# Altium schematic sheet uController.SchDoc
size A3; SheetNumber: 1; SheetTotal: 5
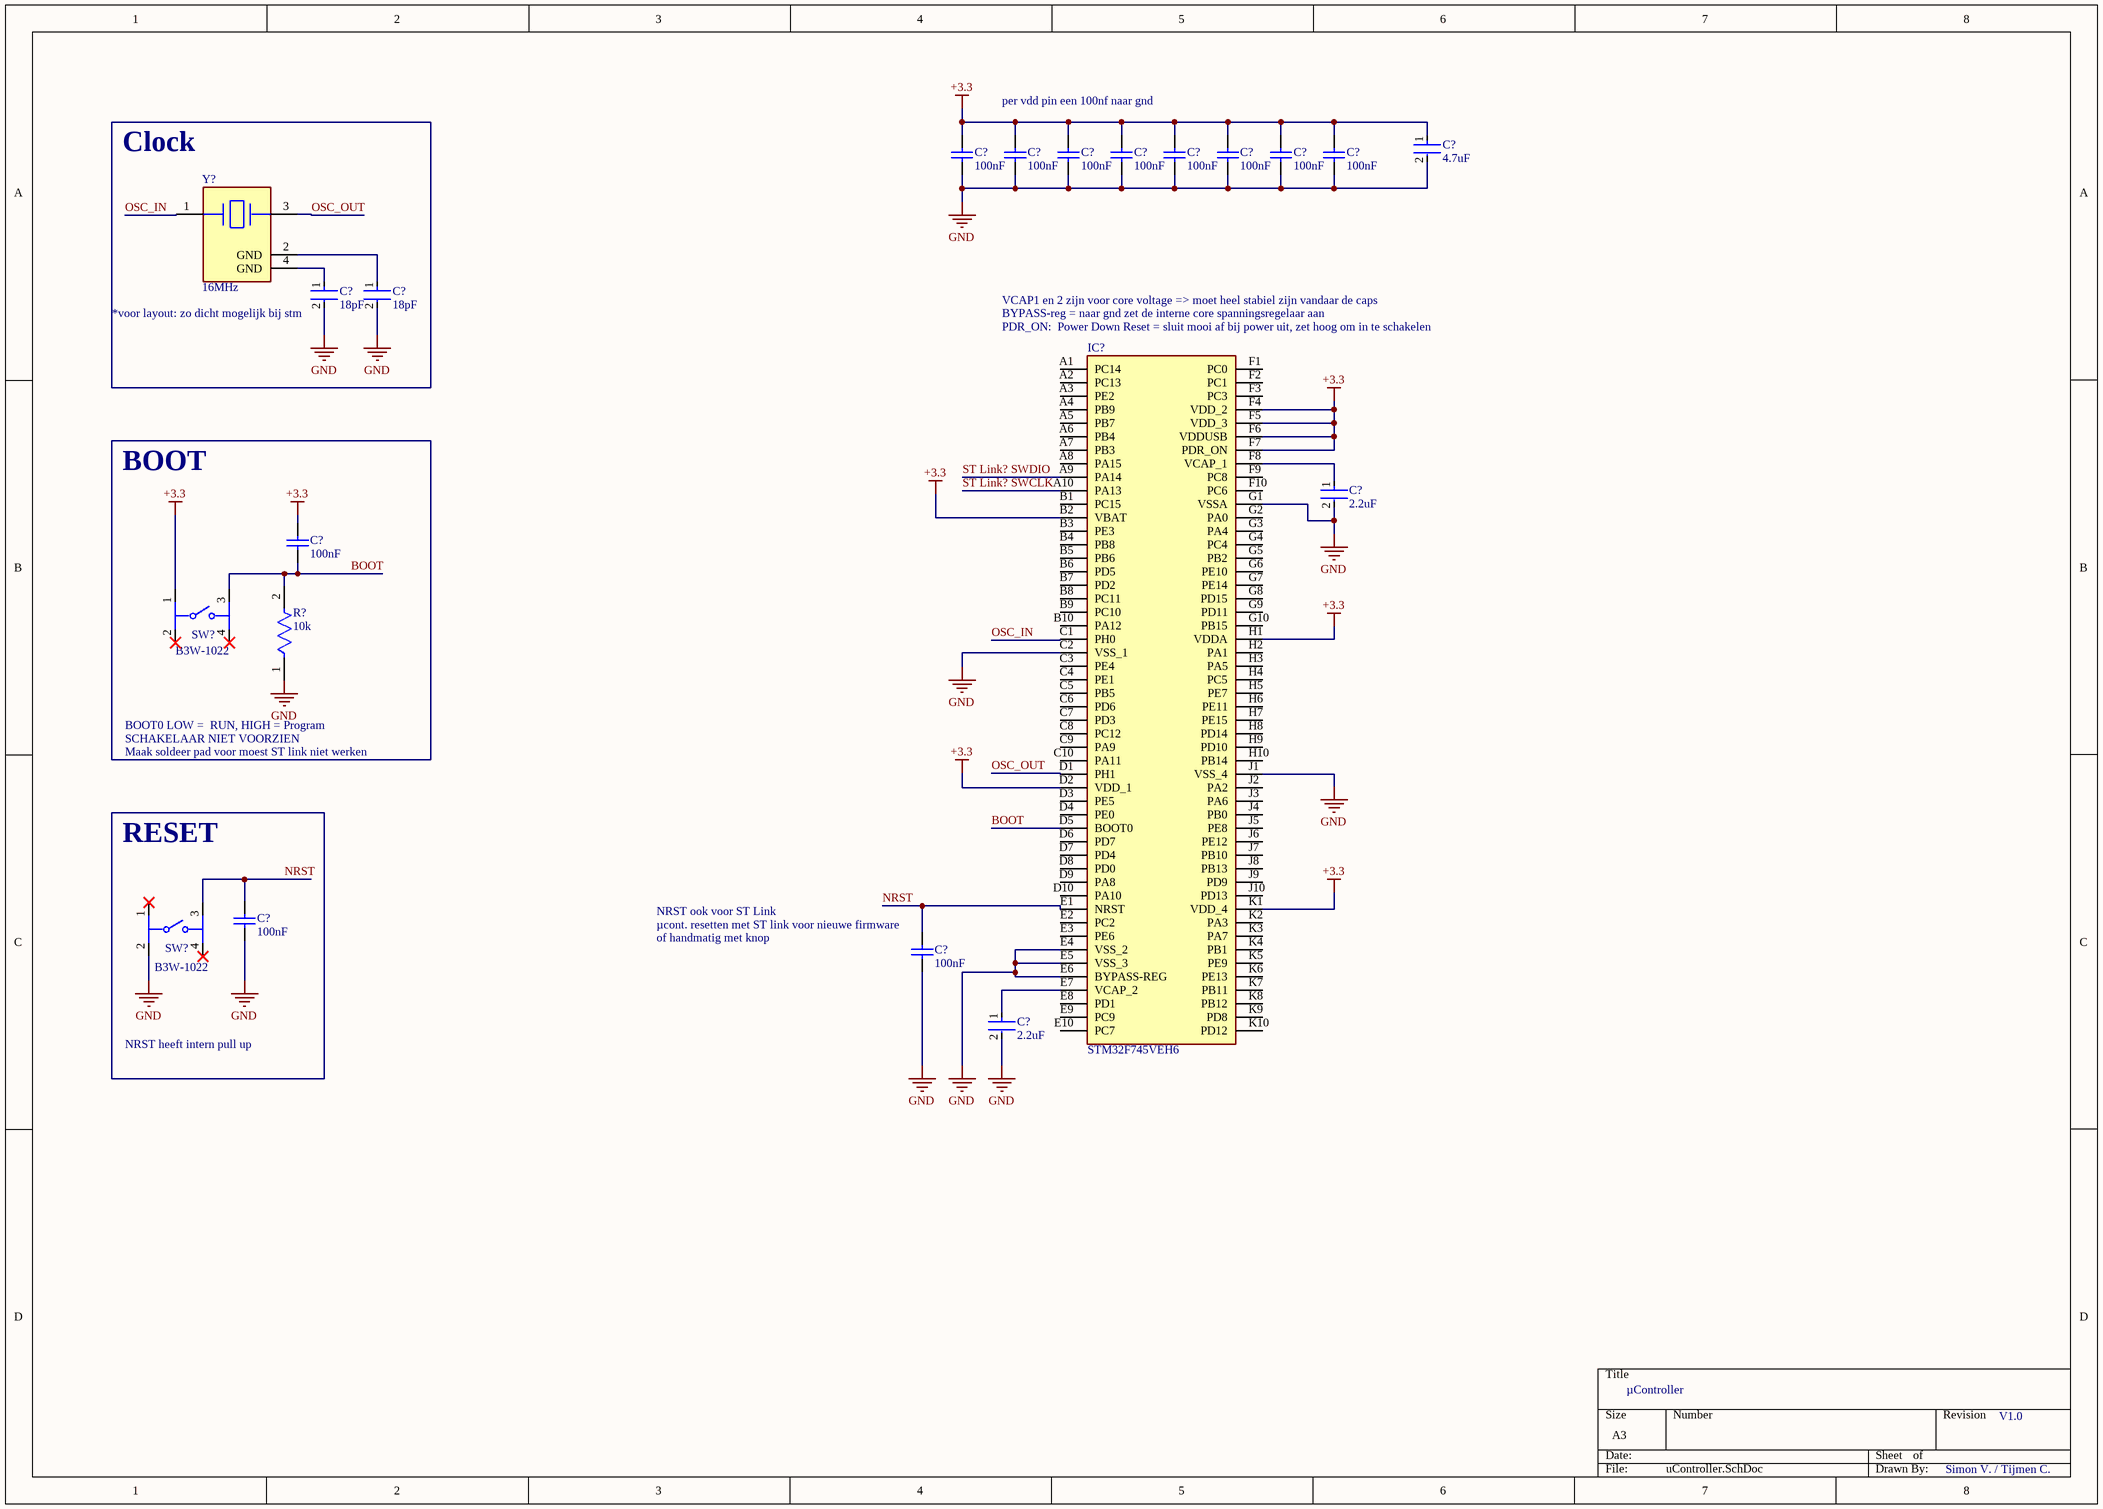
[diagram p0: uController.SchDoc]

## Parts
(Parts that share a designator on the sheet are numbered #1, #2 ... from top to bottom, then left to right.)
C?#1  4.7uF  [FP-CC0603-DC-MFG]
C?#2  100nF  [CAPC1608X92X38ML15T08]
C?#3  100nF  [CAPC1608X92X38ML15T08]
C?#4  100nF  [CAPC1608X92X38ML15T08]
C?#5  100nF  [CAPC1608X92X38ML15T08]
C?#6  100nF  [CAPC1608X92X38ML15T08]
C?#7  100nF  [CAPC1608X92X38ML15T08]
C?#8  100nF  [CAPC1608X92X38ML15T08]
C?#9  100nF  [CAPC1608X92X38ML15T08]
C?#10  18pF  [FP-C0603C-CF-MFG]
C?#11  18pF  [FP-C0603C-CF-MFG]
C?#12  2.2uF  [FP-CC0603-DA-MFG]
C?#13  100nF  [CAPC1608X92X38ML15T08]
C?#14  100nF  [CAPC1608X92X38ML15T08]
C?#15  100nF  [CAPC1608X92X38ML15T08]
C?#16  2.2uF  [FP-CC0603-DA-MFG]
IC?  STM32F745VEH6  [BGA100C80P10X10_800X800X110]
R?  10k  [FP-MCT0603-MFG]
SW?#1  B3W-1022  [FP-B3W-1022-MFG]
SW?#2  B3W-1022  [FP-B3W-1022-MFG]
Y?  16MHz  [FP-ABM8-MFG]

## Nets
+3.3: C?#1.1 C?#2.2 C?#3.2 C?#4.2 C?#5.2 C?#6.2 C?#7.2 C?#8.2 C?#9.2 C?#13.2 IC?.B2(VBAT) IC?.D2(VDD_1) IC?.F4(VDD_2) IC?.F5(VDD_3) IC?.F6(VDDUSB) IC?.F7(PDR_ON) IC?.H1(VDDA) IC?.K1(VDD_4) SW?#1.1
GND: C?#1.2 C?#2.1 C?#3.1 C?#4.1 C?#5.1 C?#6.1 C?#7.1 C?#8.1 C?#9.1 C?#10.2 C?#11.2 C?#12.2 C?#14.1 C?#15.1 C?#16.2 IC?.C2(VSS_1) IC?.E4(VSS_2) IC?.E5(VSS_3) IC?.E6(BYPASS-REG) IC?.G1(VSSA) IC?.J1(VSS_4) R?.1 SW?#2.2
BOOT: C?#13.1 IC?.D5(BOOT0) R?.2 SW?#1.3
NRST: C?#14.2 C?#15.2 IC?.E1(NRST) SW?#2.3
OSC_IN: IC?.C1(PH0) Y?.1
OSC_OUT: IC?.D1(PH1) Y?.3
ST Link? SWCLK: IC?.A10(PA13)
ST Link? SWDIO: IC?.A9(PA14)
NetC?#10_1: C?#10.1 Y?.4(GND)
NetC?#11_1: C?#11.1 Y?.2(GND)
NetC?#12_1: C?#12.1 IC?.F8(VCAP_1)
NetC?#16_1: C?#16.1 IC?.E7(VCAP_2)

Not connected (* = marked no-connect by the designer): IC? A1(PC14) A2(PC13) A3(PE2) A4(PB9) A5(PB7) A6(PB4) A7(PB3) A8(PA15) B1(PC15) B3(PE3) B4(PB8) B5(PB6) B6(PD5) B7(PD2) B8(PC11) B9(PC10) B10(PA12) C3(PE4) C4(PE1) C5(PB5) C6(PD6) C7(PD3) C8(PC12) C9(PA9) C10(PA11) D3(PE5) D4(PE0) D6(PD7) D7(PD4) D8(PD0) D9(PA8) D10(PA10) E2(PC2) E3(PE6) E8(PD1) E9(PC9) E10(PC7) F1(PC0) F2(PC1) F3(PC3) F9(PC8) F10(PC6) G2(PA0) G3(PA4) G4(PC4) G5(PB2) G6(PE10) G7(PE14) G8(PD15) G9(PD11) G10(PB15) H2(PA1) H3(PA5) H4(PC5) H5(PE7) H6(PE11) H7(PE15) H8(PD14) H9(PD10) H10(PB14) J2(PA2) J3(PA6) J4(PB0) J5(PE8) J6(PE12) J7(PB10) J8(PB13) J9(PD9) J10(PD13) K2(PA3) K3(PA7) K4(PB1) K5(PE9) K6(PE13) K7(PB11) K8(PB12) K9(PD8) K10(PD12); SW?#1 2* 4*; SW?#2 1* 4*

## Notes on the sheet
- (near C?#3) per vdd pin een 100nf naar gnd
- Clock
- (near C?#10) *voor layout: zo dicht mogelijk bij stm
- VCAP1 en 2 zijn voor core voltage => moet heel stabiel zijn vandaar de caps
- (near IC?) BYPASS-reg = naar gnd zet de interne core spanningsregelaar aan
- (near IC?) PDR_ON:  Power Down Reset = sluit mooi af bij power uit, zet hoog om in te schakelen
- BOOT
- BOOT0 LOW =  RUN, HIGH = Program
- SCHAKELAAR NIET VOORZIEN
- Maak soldeer pad voor moest ST link niet werken
- RESET
- NRST ook voor ST Link
- (near C?#15) µcont. resetten met ST link voor nieuwe firmware
- of handmatig met knop
- NRST heeft intern pull up
- µController
- V1.0
- Simon V. / Tijmen C.

## Library data of the parts
C?#1 = CMP-03422-001038-2: CAP CER 4.7UF 6.3V X7R 0603; Tolerance: 20%; RoHS Compliant: Yes; Packaging: Cut Tape; Mount: Surface Mount; Case Code (Imperial): 0603; Voltage Rating: 6.3V; Min Operating Temperature: -55°C; Case/Package: 0603; Case Code (Metric): 1608; Max Operating Temperature: 125°C; Capacitance: 4.7uF
C?#2-C?#9 C?#13-C?#15 = CMP-2006-01140-1: Part Number: VJ0603Y104MXXAC; Manufacturer: Vitramon
C?#10 C?#11 = CMP-03020-018448-1: C0603 18 pF C0G 30ppm/°C 1.00% 50 V; Manufacturer: KEMET; Manufacturer Part Number: C0603C180F5GACAUTO; Voltage Rating: 50 V; Automotive Grade: Grade 1; Tolerance: 0.01; Material: Ceramic; Height: 0.87mm; Lead Free: Yes; Category: Cap; Capacitance: 18 pF; Temperature Characteristic: C0G; Device Class L3: Ceramic Capacitors; Package: C0603C-CF; ComponentLink2Description: Datasheet; Automotive: Yes; Temperature Range Low: -55°C; Device Class L1: Passive Components; ComponentLink2URL: https://api.kemet.com/component-edge/download/datasheet/C0603C100J5GACAUTO.pdf; Octopart: https://octopart.com/c0603c180f5gacauto-kemet-91893831; Value: 18 pF; Temperature: -55°C to +125°C; Temperature Range High: +125°C; Device Class L2: Capacitors; RoHS: TRUE; Temperature Coefficient: 30ppm/°C
C?#12 C?#16 = CMP-03422-000187-1: CC0603 2.2 uF X5R 10.00% 16 V; Manufacturer: YAGEO; Manufacturer Part Number: CC0603KPX5R7BB225; Voltage Rating: 16 V; Material: Ceramic; Tolerance: 0.1; Temperature Coefficient: 15%; ComponentLink2Description: Datasheet; Device Class L3: Ceramic Capacitors; Temperature Characteristic: X5R; Package: CC0603-DA; Automotive: No; Device Class L1: Passive Components; ComponentLink2URL: http://www.yageo.com/documents/recent/UPY-GPHC_X7R_6.3V-to-50V_18.pdf; Value: 2.2 uF; RoHS: TRUE; Height: 0.9mm; Temperature Range High: +125°C; Footprint Url: http://www.yageo.com/exep/pages/download/literatures/UPY-C_GEN_24.pdf; Lead Free: Yes; Temperature Range Low: -55°C; Capacitance: 2.2 uF; Octopart: https://octopart.com/cc0603kpx5r7bb225-yageo-91091799; Device Class L2: Capacitors; Voltage: 16 V; Temperature: -55°C to +125°C; Category: Cap
IC? = STM32F745VEH6: Integrated Circuit; Manufacturer_Name: STMicroelectronics; Datasheet Link: https://www.st.com/resource/en/datasheet/stm32f745ie.pdf; Height: 1.1mm; Manufacturer_Part_Number: STM32F745VEH6; Mouser Part Number: 511-STM32F745VEH6; Mouser Price/Stock: https://www.mouser.co.uk/ProductDetail/STMicroelectronics/STM32F745VEH6?qs=dTJS0cRn7ogJy7Gdq90%252Bbw%3D%3D; Arrow Part Number: STM32F745VEH6; Arrow Price/Stock: https://www.arrow.com/en/products/stm32f745veh6/stmicroelectronics?region=nac
R? = CMP-02407-002367-1: RES SMD 100 OHM 1% 1/8W 0603; Max Power Dissipation: 100mW; Temperature Coefficient: 15ppm/°C; Resistance: 10kR; Tolerance: 0.1%; Length: 0.061inch; Min Operating Temperature: -55°C; Case/Package: 0603; Max Operating Temperature: 125°C; Number of Terminations: 2; Packaging: Tape and Reel; Width: 0.033inch; Composition: Thin Film; Height: 0.022inch; Package Quantity: 1000
SW?#1 SW?#2 = CMP-08834-000055-1: SWITCH TACTILE SPST-NO 0.05A 24V; Operating Force: 230gf; Switch Function: Off-Mom; Switch Travel: 0.25mm; Throw Configuration: SPST; Actuator Type: Standard; Illumination Type: Non-Illuminated; Ratings: IP67; Mechanical Life: 1000000Cycles; Packaging: Bulk; Termination: PC Pin; Max Operating Temperature: 70°C; RoHS Compliant: Yes; Mount: Through Hole; Min Operating Temperature: -25°C
Y? = CMP-27762-003067-1: Crystal 16MHz ±20ppm 18pF SMD-4 3.2mm x 2.5mm                      ABM8-16.000MHZ-B2-T3; Frequency Stability: 50ppm; ESR (Equivalent Series Resistance): 70R; Packaging: Tape and Reel; Load Capacitance: 18pF; Min Operating Temperature: -20°C; Case/Package: SMD/SMT; Length: 0.126inch; RoHS Compliant: Yes; Max Operating Temperature: 70°C; Width: 0.098inch; Series: ABM8; Frequency: 16MHz; Height: 0.031inch; Mount: Surface Mount; Frequency Tolerance: 20ppm